# EasyEDA Pro project Board2.epro

# Schematic Schematic2
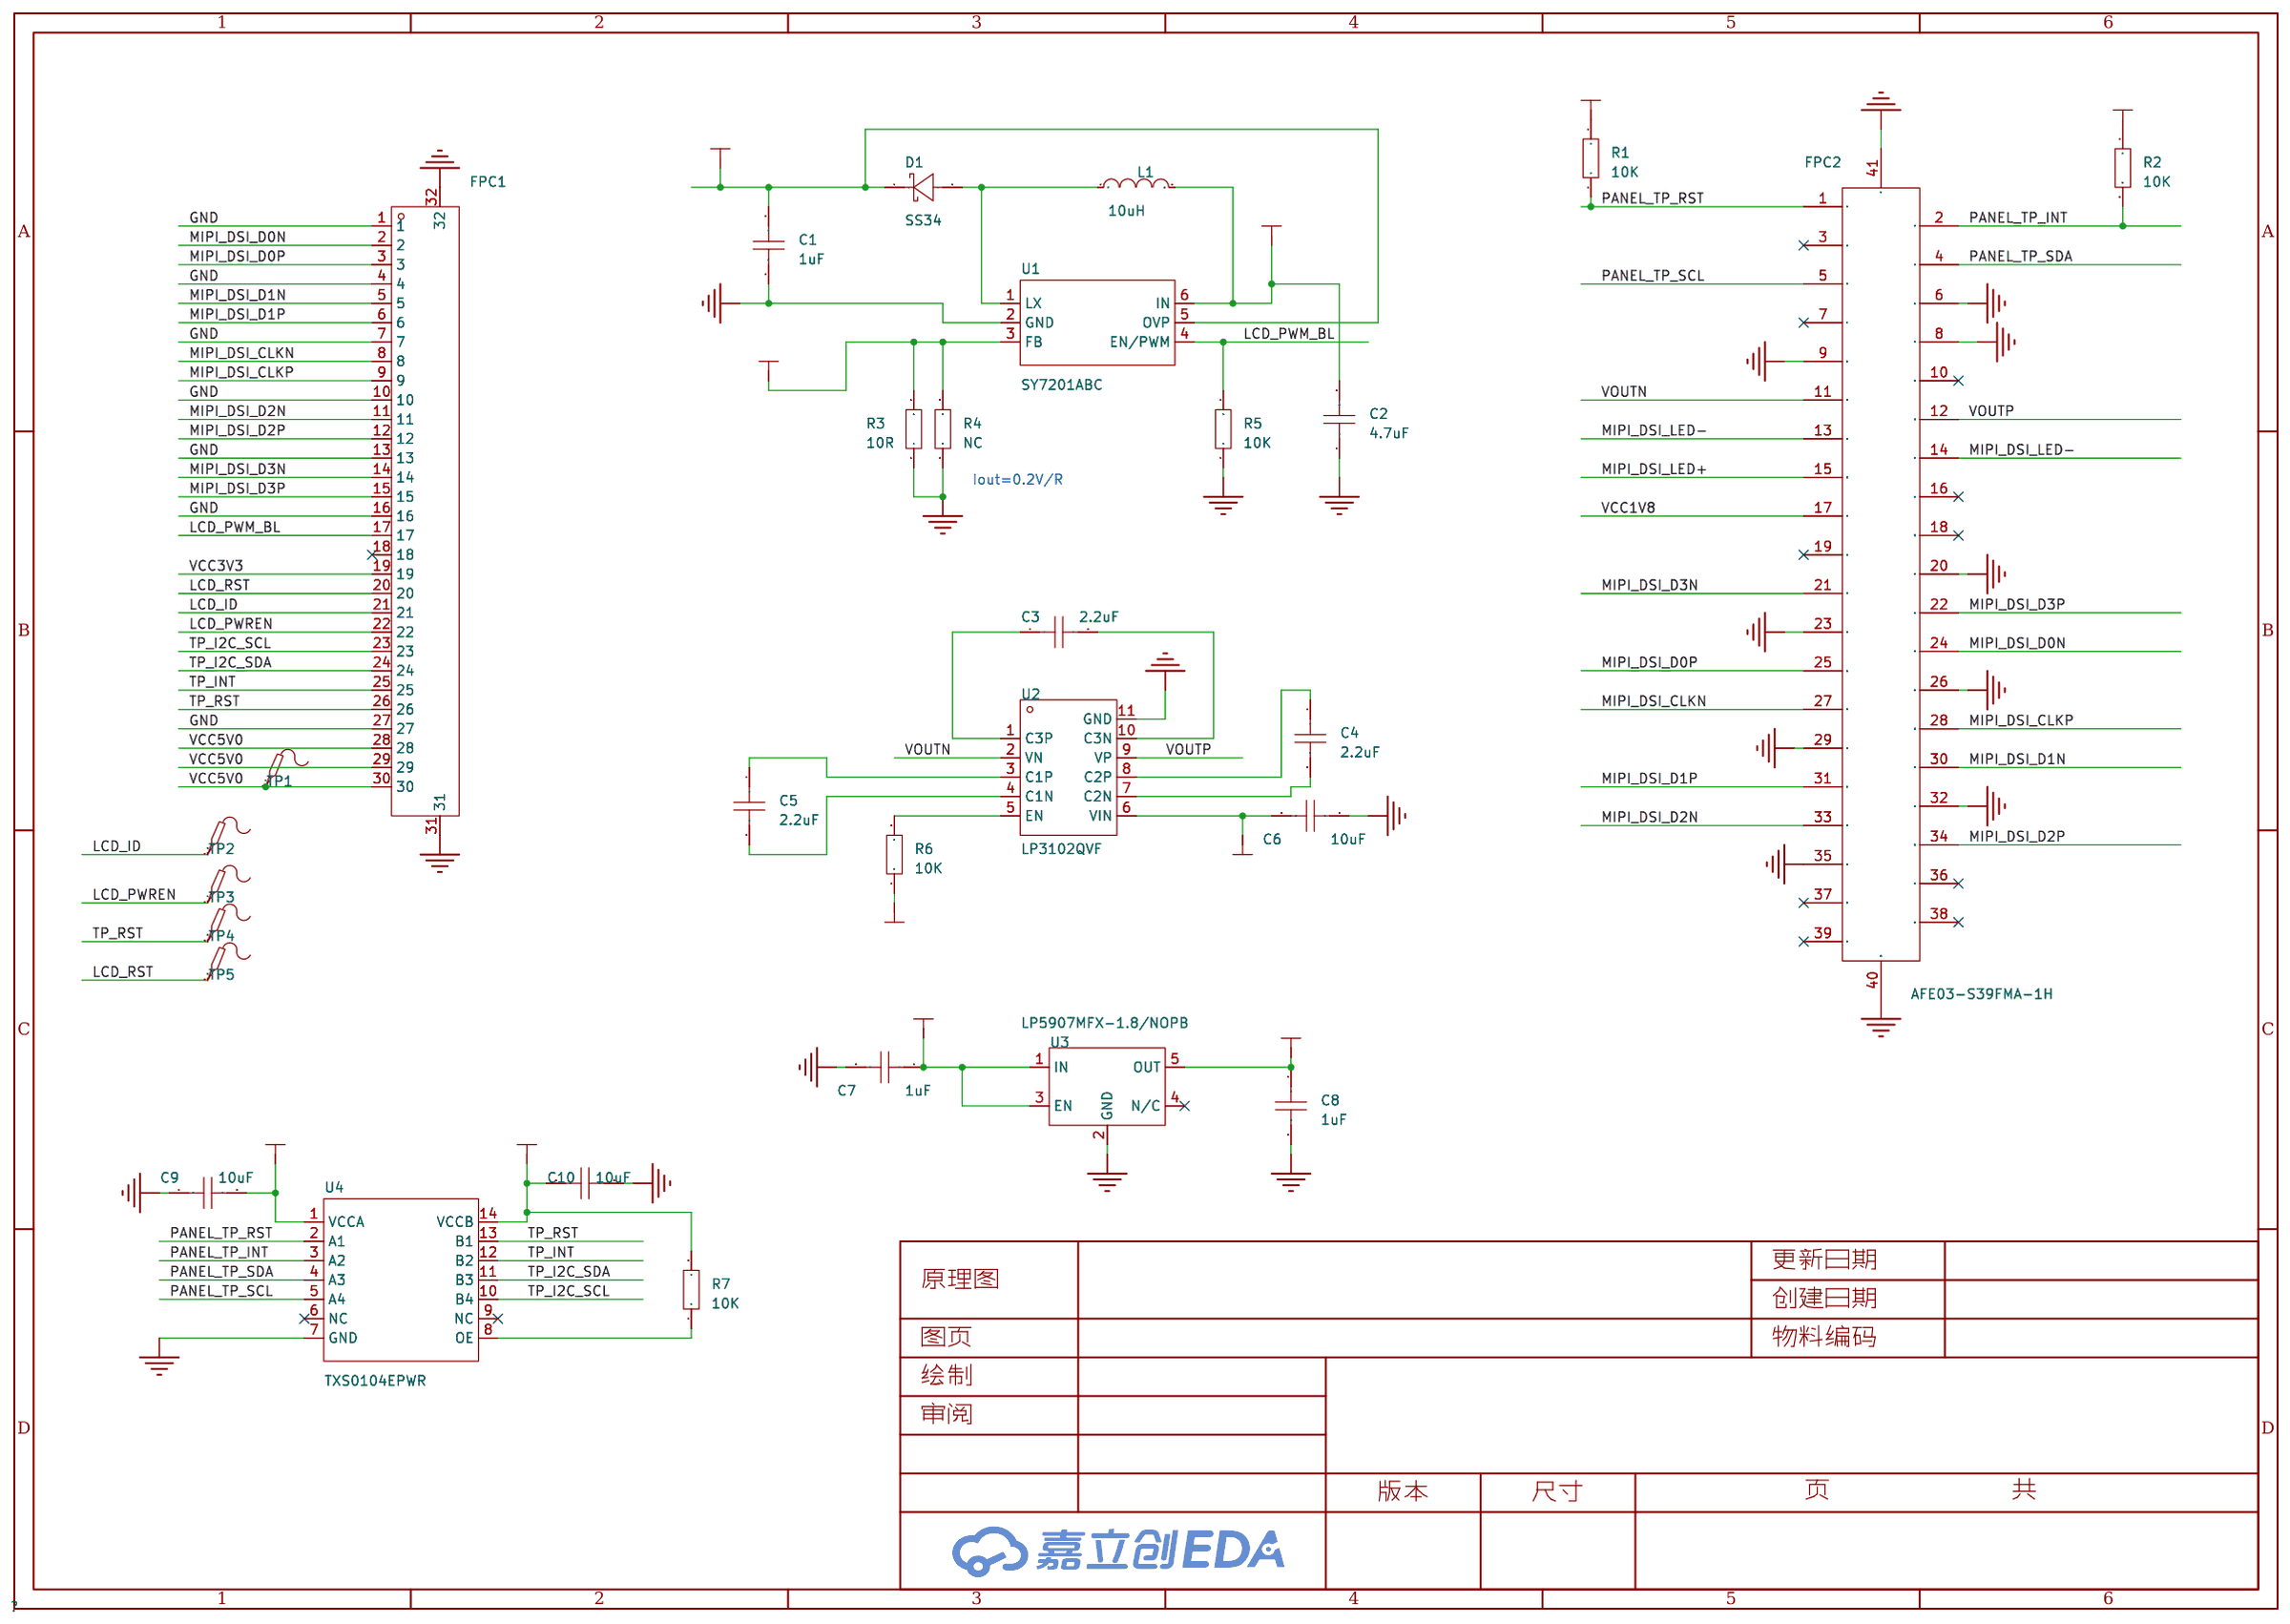
[diagram p0: schematic sheet]

## Parts
C1  1uF  [C0603]
C2  4.7uF  [C0603]
C3  2.2uF  [C0603]
C4  2.2uF  [C0603]
C5  2.2uF  [C0603]
C6  10uF  [C0603]
C7  1uF  [C0603]
C8  1uF  [C0603]
C9  10uF  [C0603]
C10  10uF  [C0603]
D1  SS34  [SMA_L4.2-W2.7-LS5.0-RD]
FPC1  FPC-05F-30PH20  [FPC-SMD_30P-P0.50_XUNPU_FPC-05F-30PH20]
FPC2  AFE03-S39FMA-1H  [FPC-SMD_P0.30-39P_FGS-XJ-H1.0]
L1  10uH  [L0603]
R1  10K  [R0603]
R2  10K  [R0603]
R3  10R  [R0603]
R4  NC  [R0603]
R5  10K  [R0603]
R6  10K  [R0603]
R7  10K  [R0603]
TP1  -  [Test-Point-0.5mm]
TP2  -  [Test-Point-0.5mm]
TP3  -  [Test-Point-0.5mm]
TP4  -  [Test-Point-0.5mm]
TP5  -  [Test-Point-0.5mm]
U1  SY7201ABC  [SOT-23-6_L2.9-W1.6-P0.95-LS2.8-BR]
U2  LP3102QVF  [TDFN-10_L3.0-W3.0-P0.50-BL-EP]
U3  LP5907MFX-1.8/NOPB  [SOT-23-5_L3.0-W1.7-P0.95-LS2.8-BR]
U4  TXS0104EPWR  [TSSOP-14_L5.0-W4.4-P0.65-LS6.4-BL]

## Library data of the parts
C1-C10 = CAP_0603: Supplier Footprint: 0603
D1 = SS34_C2837271: 二极管配置:-;正向压降(Vf):550mV@3A;直流反向耐压(Vr):40V;整流电流:3A;; LCSC Part Name: 电压:40V 电流:3A; Supplier Part: C2837271; Manufacturer: JSMSEMI(杰盛微); Supplier Footprint: SMA(DO-214AC); JLCPCB Part Class: 扩展库; Datasheet: https://item.szlcsc.com/datasheet/SS34/3007843.html; Supplier: LCSC; Voltage - Forward(Vf@If): 550mV@3A; Voltage - DC Reverse(Vr): 40V; Current - Rectified: 3A
FPC1 = FPC-05F-30PH20: 锁定特性:翻盖式;触点类型:卧贴;触点数量:30P;间距:0.5mm;安装方式:下接;工作温度:-25℃~+85℃;; LCSC Part Name: 翻盖式 卧贴 P数:30P 间距:0.5mm; Supplier Part: C2856808; Manufacturer: XUNPU(讯普); Supplier Footprint: SMD,P=0.5mm,卧贴; JLCPCB Part Class: 扩展库; Datasheet: https://item.szlcsc.com/datasheet/FPC-05F-30PH20/3056906.html; Supplier: LCSC; Locking Feature: 翻盖式; Contact Type: 卧贴; Number of Contacts: 30P; Pitch: 0.5mm; Mounting Type: 下接; FFC, FCB Thickness: 0.3mm; Height Above Board: 2mm; Contact Material: 磷青铜; Contact Plating: 锡; Operating Temperature: -25℃~+85℃; Rated Voltage (Max): 50V; Current Rating (Max): 500mA
FPC2 = AFE03-S39FMA-1H: 锁定特性:翻盖式;触点类型:下接;触点数量:39P;间距:0.3mm;安装方式:卧贴;; LCSC Part Name: 翻盖式 下接 P数:39P 间距:0.3mm; Supplier Part: C262546; Manufacturer: JS(钜硕电子); Supplier Footprint: SMD,P=0.3mm,卧贴; JLCPCB Part Class: 扩展库; Datasheet: https://item.szlcsc.com/datasheet/AFE03-S39FMA-1H/253855.html; Supplier: LCSC; Locking Feature: 翻盖式; Contact Type: 下接; Number of Contacts: 39P; Pitch: 0.3mm; Mounting Type: 卧贴; FFC, FCB Thickness: 0.2mm; Height Above Board: 1mm; Contact Material: 铜合金; Contact Plating: 锡
L1 = LQM18FN100M00D: 电感值:10uH;精度:±20%;额定电流:50mA;饱和电流(Isat):50mA;直流电阻(DCR):1.17Ω;; LCSC Part Name: 10uH ±20% 50mA; Supplier Part: C86083; Manufacturer: muRata(村田); Supplier Footprint: 0603; JLCPCB Part Class: 扩展库; Datasheet: https://item.szlcsc.com/datasheet/LQM18FN100M00D/87259.html; Supplier: LCSC; Tolerance: ±20%; Current Rating: 50mA; Current - Saturation (Isat): 50mA; DC Resistance(DCR): 1.17Ω; Frequency - Self Resonant: 30MHz
R1-R7 = Res_0603: Supplier Footprint: 0603
TP1-TP5 = Test-Point: Test Point 测试点
U1 = SY7201ABC: 类型:DC-DC;工作电压(DC):2.5V~30V;开关频率:1MHz;通道数:-;输出电压:-;输出电流:-;调光:PWM;拓扑结构:升压;; LCSC Part Name: 30V高电流升压型LED驱动器; Supplier Part: C82173; Manufacturer: Silergy(矽力杰); Supplier Footprint: SOT-23-6; JLCPCB Part Class: 扩展库; Datasheet: https://item.szlcsc.com/datasheet/SY7201ABC/83328.html; Supplier: LCSC; Type: DC-DC; Voltage - Input(DC): 2.5V~30V; Frequency - Switching: 1MHz; Dimming: PWM; Features: 过温保护(OTP)；过压保护(OVP); Topology: 升压; Operating temperature: -40℃~+125℃; Switch Tube (Built-In/External): 内置
U2 = LP3102QVF: LP3102 DC/DC 转换器集成了两个低噪声、高效率的电荷泵，用于双路输出，包括一路反相输出和一路升压输出。该器件的输入电压范围为 2.5V 至 4.8V，可提供两倍于输入电压的升压输出电压（VP）。负反相输出（VN）是正输出 VP 的 -1 倍反相; LCSC Part Name: 双通道电荷泵电源解决方案，适用于TFT LCD面板; Supplier Part: C517005; Manufacturer: LOWPOWER(微源半导体); Supplier Footprint: TDFN-10-EP(3x3); JLCPCB Part Class: 扩展库; Datasheet: https://item.szlcsc.com/datasheet/LP3102QVF/533370.html; Supplier: LCSC; Operating Voltage: 2.5V~4.8V; Operating Temperature: -40℃~+85℃; Function: 升压；反相; Output Voltage: 5.5V~5.9V；-5.9V~-5.5V; Output Current: 120mA
U3 = LP5907MFX-1.8/NOPB: 输出类型:固定;工作电压:5.5V;输出电压:1.8V;输出电流:250mA;电源纹波抑制比(PSRR):82dB@(1kHz);输出极性:正极;; LCSC Part Name: 具有低 IQ 和使能功能的 250mA、低噪声、高 PSRR、超低压降稳压器; Supplier Part: C92498; Manufacturer: TI(德州仪器); Supplier Footprint: SOT-23-5; JLCPCB Part Class: 扩展库; Datasheet: https://www.ti.com/cn/lit/gpn/lp5907; Supplier: LCSC; Output Type: 固定; Voltage - Supply: 5.5V; Output Voltage: 1.8V; Output Current: 250mA; Power Supply Rejection Ratio (PSRR): 82dB@(1kHz); Voltage Dropout: 120mV@(250mA); standby current: 12uA; Noise: 6.5uVrms; Features: 短路保护；过热保护；带使能；欠压锁定; Operating Temperature: -40℃~+125℃@(Tj); Output Configuration: 正极; Number of Outputs: 1
U4 = TXS0104EPWR: 数据速率:24Mbps;工作电压(VCCA):1.65V~3.6V;工作电压(VCCB):2.3V~5.5V;元件数:1;每个电路通道数:4;; LCSC Part Name: 4位双向电压电平转换器; Supplier Part: C44955; Manufacturer: TI(德州仪器); Supplier Footprint: TSSOP-14; JLCPCB Part Class: 扩展库; Datasheet: https://www.ti.com/cn/lit/gpn/txs0104e; Supplier: LCSC; Channel Type: 双向; Data Rate: 24Mbps; Voltage - Supply(VCCA): 1.65V~3.6V; Voltage - Supply(VCCB): 2.3V~5.5V; Number of Elements: 1; Number of Circuits: 4; Output Type: 推挽式；开漏; Operating Temperature: -40℃~+85℃; Features: 自动方向检测

## Nets
GND: C1.1 C2.1 C6.1 C7.2 C8.2 C9.1 C10.1 FPC1.1 FPC1.4 FPC1.7 FPC1.10 FPC1.13 FPC1.16 FPC1.27 FPC1.31 FPC1.32 FPC2.6 FPC2.8 FPC2.9 FPC2.20 FPC2.23 FPC2.26 FPC2.29 FPC2.32 FPC2.35 FPC2.40 FPC2.41 R3.1 R4.1 R5.1 U1.2(GND) U2.11(GND) U3.2(GND) U4.7(GND)
VCC1V8: C8.1 C9.2 FPC2.17 R1.1 R2.1 U3.5(OUT) U4.1(VCCA)
VCC3V3: C6.2 C10.2 FPC1.19 R6.1 R7.2 U2.6(VIN) U4.14(VCCB)
VCC5V0: C2.2 C7.1 FPC1.28 FPC1.29 FPC1.30 L1.2 TP1.1 U1.6(IN) U3.1(IN) U3.3(EN)
LCD_ID: FPC1.21 TP2.1
LCD_PWM_BL: FPC1.17 R5.2 U1.4(EN/PWM)
LCD_PWREN: FPC1.22 TP3.1
LCD_RST: FPC1.20 TP5.1
MIPI_DSI_CLKN: FPC1.8 FPC2.27
MIPI_DSI_CLKP: FPC1.9 FPC2.28
MIPI_DSI_D0N: FPC1.2 FPC2.24
MIPI_DSI_D0P: FPC1.3 FPC2.25
MIPI_DSI_D1N: FPC1.5 FPC2.30
MIPI_DSI_D1P: FPC1.6 FPC2.31
MIPI_DSI_D2N: FPC1.11 FPC2.33
MIPI_DSI_D2P: FPC1.12 FPC2.34
MIPI_DSI_D3N: FPC1.14 FPC2.21
MIPI_DSI_D3P: FPC1.15 FPC2.22
MIPI_DSI_LED+: C1.2 D1.1(K) FPC2.15 U1.5(OVP)
MIPI_DSI_LED-: FPC2.13 FPC2.14 R3.2 R4.2 U1.3(FB)
PANEL_TP_INT: FPC2.2 R2.2 U4.3(A2)
PANEL_TP_RST: FPC2.1 R1.2 U4.2(A1)
PANEL_TP_SCL: FPC2.5 U4.5(A4)
PANEL_TP_SDA: FPC2.4 U4.4(A3)
TP_I2C_SCL: FPC1.23 U4.10(B4)
TP_I2C_SDA: FPC1.24 U4.11(B3)
TP_INT: FPC1.25 U4.12(B2)
TP_RST: FPC1.26 TP4.1 U4.13(B1)
VOUTN: FPC2.11 U2.2(VN)
VOUTP: FPC2.12 U2.9(VP)
$1N641: D1.2(A) L1.1 U1.1(LX)
$1N1590: C3.1 U2.1(C3P)
$1N1594: C5.1 U2.3(C1P)
$1N1596: C5.2 U2.4(C1N)
$1N1598: R6.2 U2.5(EN)
$1N1600: C4.2 U2.7(C2N)
$1N1602: C4.1 U2.8(C2P)
$1N1606: C3.2 U2.10(C3N)
$1N4917: R7.1 U4.8(OE)

Not connected (* = marked no-connect by the designer): FPC1 18*; FPC2 3* 7* 10* 16* 18* 19* 36* 37* 38* 39*; U3 4(N/C)*; U4 6(NC)* 9(NC)*

## Notes on the sheet
- Iout=0.2V/R

# Board PCB2
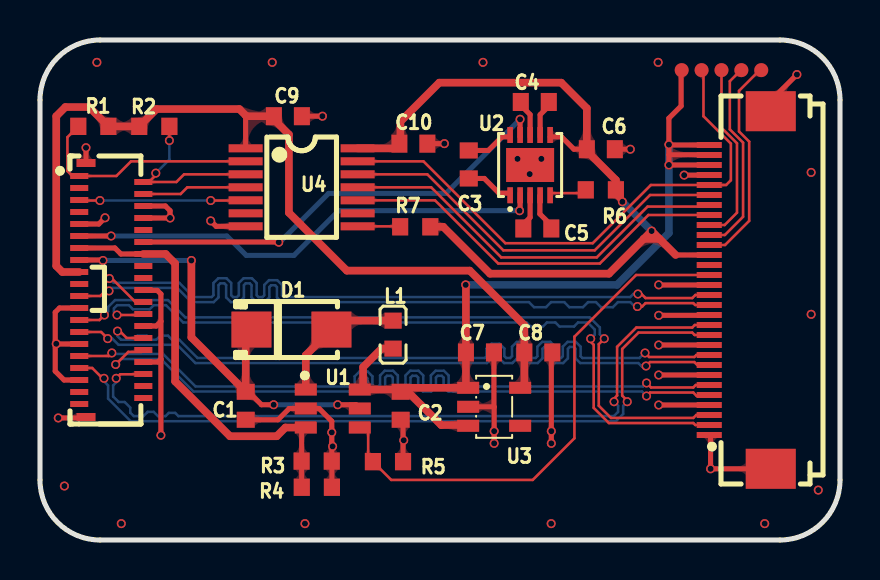
[diagram p1: board, top side]
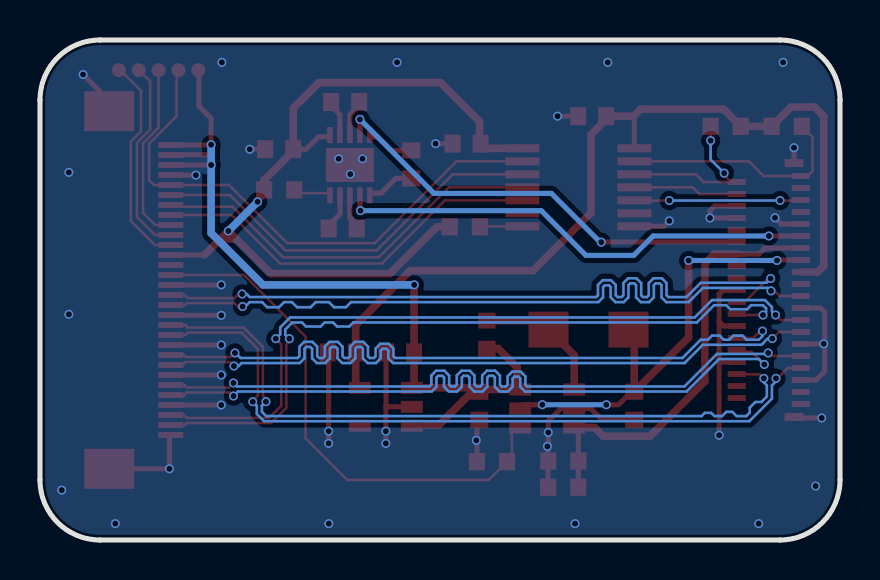
[diagram p2: board, bottom side, seen from below]

Outline 40 x 25 mm; copper layers: Top Layer, Bottom Layer. Coordinates in mm from the lower left corner of the outline.
Outline path: 0,22 0,3 arc(0.88,0.88) 3,0 37,0 arc(39.12,0.88) 40,3 40,22 arc(39.12,24.12) 37,25 3,25 arc(0.88,24.12) 0,22
Stack: Top Layer 0.035mm / Dielectric1 1.51mm FR4 er 4.5 / Bottom Layer 0.035mm

## Design rules (mm)
net MIPI_DSI_D3P: DP5
net MIPI_DSI_D3N: DP5
net MIPI_DSI_D2P: DP4
net MIPI_DSI_D2N: DP4
net MIPI_DSI_CLKP: DP1
net MIPI_DSI_CLKN: DP1
net MIPI_DSI_D1P: DP3
net MIPI_DSI_D1N: DP3
net MIPI_DSI_D0P: DP2
net MIPI_DSI_D0N: DP2
template: 用户自定义配置
spacing copperThickness1oz (default): track to track 0.102, other pairs 0.127 to 0.3
spacing copperThickness2oz: track to track 0.203, other pairs 0.152 to 0.3
track width copperThickness1oz (default): min 0.127, default 0.127, max 2.54
track width copperThickness2oz: min 0.203, default 0.254, max 2.54
track width 10mil: min 0.127, default 0.254, max 2.54
differential pair differentialPair (default): width min 0.127, default 0.127, max 2.54; gap min 0.127, default 0.127
via viaSize (default): diameter min 0.4, default 0.45, max 10; hole min 0.3, default 0.305, max 6.3
net MIPI_DSI_LED+ uses 10mil
net GND uses 10mil
net VCC5V0 uses 10mil
net VCC3V3 uses 10mil
net VCC1V8 uses 10mil
net VOUTN uses 10mil
net VOUTP uses 10mil
net MIPI_DSI_LED- uses 10mil

## Placement (name value [footprint] x y rotation side)
C1  1uF  [C0603]  10.29 6.71 90 top
C2  4.7uF  [C0603]  18.03 6.71 90 top
C3  2.2uF  [C0603]  21.44 18.78 90 top
C4  2.2uF  [C0603]  24.74 21.9 0 top
C5  2.2uF  [C0603]  24.87 15.58 0 top
C6  10uF  [C0603]  28.04 19.54 180 top
C7  1uF  [C0603]  22 9.38 0 top
C8  1uF  [C0603]  24.92 9.38 0 top
C9  10uF  [C0603]  12.4 21.19 180 top
C10  10uF  [C0603]  18.67 19.82 180 top
D1  SS34  [SMA_L4.2-W2.7-LS5.0-RD]  12.57 10.52 0 top
FPC1  FPC-05F-30PH20  [FPC-SMD_30P-P0.50_XUNPU_FPC-05F-30PH20]  35 12.5 90 top
FPC2  AFE03-S39FMA-1H  [FPC-SMD_P0.30-39P_FGS-XJ-H1.0]  3.5 12.5 270 top
L1  10uH  [L0603]  17.65 10.27 270 top
R1  10K  [R0603]  2.67 20.68 180 top
R2  10K  [R0603]  5.72 20.68 0 top
R3  10R  [R0603]  13.84 3.94 180 top
R4  NC  [R0603]  13.84 2.64 180 top
R5  10K  [R0603]  17.4 3.92 180 top
R6  10K  [R0603]  28.04 17.51 180 top
R7  10K  [R0603]  18.76 15.66 0 top
TP1  -  [Test-Point-0.5mm]  32.08 23.49 90 top
TP2  -  [Test-Point-0.5mm]  35.07 23.49 90 top
TP3  -  [Test-Point-0.5mm]  34.07 23.49 90 top
TP4  -  [Test-Point-0.5mm]  33.08 23.49 90 top
TP5  -  [Test-Point-0.5mm]  36.06 23.49 90 top
U1  SY7201ABC  [SOT-23-6_L2.9-W1.6-P0.95-LS2.8-BR]  14.64 6.57 180 top
U2  LP3102QVF  [TDFN-10_L3.0-W3.0-P0.50-BL-EP]  24.51 18.75 0 top
U3  LP5907MFX-1.8/NOPB  [SOT-23-5_L3.0-W1.7-P0.95-LS2.8-BR]  22.71 6.66 180 top
U4  TXS0104EPWR  [TSSOP-14_L5.0-W4.4-P0.65-LS6.4-BL]  13.08 17.63 270 top

## Footprints (pads in the part's own frame, mm; a bottom-side part is the same pattern mirrored in y, then rotated)
C0603
  rect 0.8x0.9 smd: 1(-0.7,0) 2(0.7,0)
FPC-SMD_30P-P0.50_XUNPU_FPC-05F-30PH20
  rect 0.3x1.25 smd: 1(-7.25,1.538) 2(-6.75,1.538) 3(-6.25,1.538) 4(-5.75,1.538) 5(-5.25,1.538) 6(-4.75,1.538) 7(-4.25,1.538) 8(-3.75,1.538) 9(-3.25,1.538) 10(-2.75,1.538) 11(-2.25,1.538) 12(-1.75,1.538) 13(-1.25,1.538) 14(-0.75,1.538) 15(-0.25,1.538) 16(0.25,1.538) 17(0.75,1.538) 18(1.25,1.538) 19(1.75,1.538) 20(2.25,1.538) 21(2.75,1.538) 22(3.25,1.538) 23(3.75,1.538) 24(4.25,1.538) 25(4.75,1.538) 26(5.25,1.538) 27(5.75,1.538) 28(6.25,1.538) 29(6.75,1.538) 30(7.25,1.538)
  rect 2x2.5 smd: 31(8.94,-1.538) 32(-8.94,-1.538)
FPC-SMD_P0.30-39P_FGS-XJ-H1.0
  rect 0.3x0.9 smd: 1(-5.7,-1.54) 2(-5.4,1.665) 3(-5.1,-1.54) 4(-4.8,1.665) 5(-4.5,-1.54) 6(-4.2,1.665) 7(-3.9,-1.54) 8(-3.6,1.665) 9(-3.3,-1.54) 10(-3,1.665) 11(-2.7,-1.54) 12(-2.4,1.665) 13(-2.1,-1.54) 14(-1.8,1.665) 15(-1.5,-1.54) 16(-1.2,1.665) 17(-0.9,-1.54) 18(-0.6,1.665) 19(-0.3,-1.54) 20(0,1.665) 21(0.3,-1.54) 22(0.6,1.665) 23(0.9,-1.54) 24(1.2,1.665) 25(1.5,-1.54) 26(1.8,1.665) 27(2.1,-1.54) 28(2.4,1.665) 29(2.7,-1.54) 30(3,1.665) 31(3.3,-1.54) 32(3.6,1.665) 33(3.9,-1.54) 34(4.2,1.665) 35(4.5,-1.54) 36(4.8,1.665) 37(5.1,-1.54) 38(5.4,1.665) 39(5.7,-1.54)
  rect 0.4x0.95 smd: 40(-6.35,-1.2) 41(6.35,-1.2)
L0603
  rect 0.8x0.864 smd: 1(-0.7,0) 2(0.7,0)
R0603
  rect 0.806x0.864 smd: 1(-0.753,0) 2(0.753,0)
SMA_L4.2-W2.7-LS5.0-RD
  rect 2x1.8 smd: 1(-2,0) 2(2,0)
SOT-23-5_L3.0-W1.7-P0.95-LS2.8-BR
  rect 1.1x0.6 smd: 1(1.3,-0.95) 2(1.3,0) 3(1.3,0.95) 4(-1.3,0.95) 5(-1.3,-0.95)
SOT-23-6_L2.9-W1.6-P0.95-LS2.8-BR
  rect 1.1x0.6 smd: 1(1.35,-0.95) 2(1.35,0) 3(1.35,0.95) 4(-1.35,0.95) 5(-1.35,0) 6(-1.35,-0.95)
TDFN-10_L3.0-W3.0-P0.50-BL-EP
  rect 0.28x0.8 smd: 1(-1,-1.513) 2(-0.5,-1.513) 3(0,-1.513) 4(0.5,-1.513) 5(1,-1.513) 6(1,1.5) 7(0.5,1.5) 8(0,1.5) 9(-0.5,1.5) 10(-1,1.5)
  rect 2.4x1.7 smd: 11(0,0)
Test-Point-0.5mm
  round 0.7 smd: 1(0,0)
TSSOP-14_L5.0-W4.4-P0.65-LS6.4-BL
  rect 0.4x1.7 smd: 1(-1.95,-2.8) 2(-1.3,-2.8) 3(-0.65,-2.8) 4(0,-2.8) 5(0.65,-2.8) 6(1.3,-2.8) 7(1.95,-2.8) 8(1.95,2.8) 9(1.3,2.8) 10(0.65,2.8) 11(0,2.8) 12(-0.65,2.8) 13(-1.3,2.8) 14(-1.95,2.8)

## Nets
As in the schematic.

Pads without a net: FPC1 18; FPC2 3 7 10 16 18 19 36 37 38 39; U3 4; U4 6 9

## Via types
v1: diameter 0.45, hole 0.305, Top Layer to Bottom Layer, 77 vias

## Routing (per net, layer and track width the routed paths; a pad name or vN(x,y) marks a point on that pad's centre or on a via; arc(x,y) is an arc through that point)
GND: length 69.9
  Top Layer w0.254: 6.04,9.05 6.04,10.93 ; 6.04,9.05 5.9,8.9 FPC2.32 ; 6.04,9.05 v1(6.04,5.24) ; 6.04,10.93 6.04,12.3 5.87,12.48 5.19,12.48 FPC2.20 ; 6.04,10.93 5.82,10.7 FPC2.26 ; FPC1.4 v1(30.94,6.75) ; FPC1.7 v1(30.94,8.25) ; C2.1 18.15,5.89 18.15,4.99 ; 14.59,4.86 R3.1 14.6,3.94 R4.1 ; 14.59,4.86 v1(14.63,4.68) ; 14.59,4.86 v1(14.59,5.38) 14.59,5.94 13.96,6.57 12.46,6.57 11.9,6.01 C1.1 ; FPC1.32 v1(33.53,3.56) 33.53,5.18 FPC1.1 ; v1(0.81,9.81) 0.76,9.76 0.76,8.44 1.2,8 FPC2.35 ; v1(0.81,9.81) 0.76,9.86 0.76,11.39 0.98,11.6 FPC2.23 ; v1(0.81,9.81) 0.82,9.8 FPC2.29 ; FPC1.10 v1(30.94,9.75) ; v1(37.85,23.27) 36.54,21.96 FPC1.31 ; 22.7,6.66 22.71,6.65 v1(22.71,5.44) v1(22.71,4.83) ; 22.7,6.66 C7.2 ; 22.7,6.66 U3.2 ; v1(30.94,11.23) 33.45,11.23 FPC1.13 ; FPC2.8 v1(6.5,16.1) 6.5,16.47 6.27,16.7 FPC2.6 ; v1(3.25,16.11) 2.94,15.8 FPC2.9 ; v1(0.91,6.1) 2.25,6.1 FPC2.41 ; v1(8.53,15.96) 8.81,15.68 U4.7 ; 18.15,4.99 R5.1 ; 18.15,4.99 v1(18.19,4.99) ; C6.1 v1(29.51,19.54) ; v1(25.57,4.83) v1(25.57,5.44) 25.57,9.33 C8.2 ; FPC2.40 v1(2.3,19.61) ; C10.1 v1(20.22,19.82) ; C9.1 v1(14.12,21.19) ; FPC1.16 30.94,12.75 v1(30.94,12.76) ; v1(32.21,18.24) 33.46,18.24 FPC1.27
  vias: v1(1.22,2.7) v1(2.84,23.88) v1(4.06,0.82) v1(11.61,23.88) v1(13.25,0.82) v1(22.15,23.88) v1(23.88,19.06) v1(24.49,18.29) v1(25.07,19.06) v1(25.56,0.82) v1(30.91,23.88) v1(36.23,0.82) v1(38.56,18.38) v1(38.56,11.28) v1(38.91,2.5)
VCC1V8: length 44.9
  Top Layer w0.254: 10.28,21.23 U4.1 10.3,19.56
  Top Layer w0.381: FPC2.17 1.12,13.4 0.81,13.7 0.81,21.19 1.27,21.65 2.46,21.65 R1.1 R2.1 5.82,21.55 9.97,21.55 10.32,21.19 C9.2 11.69,21.03 12.45,20.28 12.45,16.36 15.34,13.47 21.49,13.47 24.22,10.74 C8.1 24.22,7.82 U3.5
VCC3V3: length 40.6
  Top Layer w0.254: v1(29.12,16.91) 28.79,17.24 R6.1 ; C6.2 26.7,19.54 26.08,20.16 25.51,20.16 ; FPC1.19 31.78,14.25
  Top Layer w0.381: U4.14 17.73,19.58 18.02,19.87 18.02,20.92 19.96,22.87 26.06,22.87 27.34,21.58 C6.2 27.34,19.45 28.79,18 R6.1 ; 30.19,15.06 28.45,13.32 22.5,13.32 20.16,15.66 R7.2 ; 30.19,15.06 v1(30.58,15.45) 30.98,15.06 ; 30.19,15.06 30.98,15.06 ; 30.98,15.06 31.78,14.25
  Bottom Layer w0.381: v1(30.58,15.45) v1(29.12,16.91)
VCC5V0: length 44.6
  Top Layer w0.254: FPC1.29 33.45,19.26 31.44,19.26 ; v1(31.44,19.77) 31.44,19.26 ; v1(31.44,19.77) 31.44,21.09 32.06,21.7 32.06,23.46 TP1.1 ; v1(31.44,19.77) 31.46,19.75 FPC1.30 ; 31.44,19.26 v1(31.44,18.75) FPC1.28
  Top Layer w0.381: v1(21.28,12.76) 21.3,12.75 C7.1 21.3,7.72 U3.1 18.23,7.61 C2.2 ; U3.3 21.37,5.75 20.06,5.75 18.39,7.41 C2.2 ; C2.2 17.92,7.52 U1.6 16.15,7.69 16.15,8.64 17.08,9.57 L1.2
  Bottom Layer w0.381: v1(31.44,19.77) v1(31.44,18.75) 31.44,15.35 28.85,12.76 v1(21.28,12.76)
LCD_ID: length 10.1
  Top Layer w0.127: FPC1.21 34.24,15.25 35.15,16.16 35.15,19.87 34.49,20.53 34.49,22.94 35.04,23.49 34.84,23.49
LCD_PWM_BL: length 26.5
  Top Layer w0.127: U1.4 16.18,5.62 16.41,5.39 16.41,4.16 R5.2 17.56,3 24.64,3 26.72,5.09 26.72,10.17 29.8,13.25 FPC1.17
LCD_PWREN: length 9.1
  Top Layer w0.127: FPC1.22 34.24,15.75 34.85,16.36 34.85,19.84 34.07,20.61 TP3.1
LCD_RST: length 10.7
  Top Layer w0.127: 36.06,23.39 35.88,23.39 34.95,22.46 34.95,20.43 35.46,19.92 35.46,15.96 34.25,14.75 FPC1.20
MIPI_DSI_CLKN: length 37.1
  Top Layer w0.127: v1(30.3,8.7) 30.5,8.9 32.72,8.9 32.91,8.7 33.41,8.7 FPC1.8 ; v1(3.39,10.07) 3.06,10.4 FPC2.27
  Bottom Layer w0.127: v1(30.3,8.7) 30.07,8.7 29.92,8.85 27.01,8.85 26.78,9.08 26.78,9.56 26.69,9.65 26.48,9.65 26.39,9.56 26.39,9.08 26.16,8.85 25.74,8.85 25.51,9.08 25.51,9.56 25.42,9.65 25.21,9.65 25.12,9.56 25.12,9.08 24.89,8.85 24.47,8.85 24.24,9.08 24.24,9.56 24.15,9.65 23.94,9.65 23.85,9.56 23.85,9.08 23.62,8.85 23.2,8.85 22.97,9.08 22.97,9.47 22.88,9.56 22.67,9.56 22.58,9.47 22.58,9.08 22.35,8.85 7.77,8.85 6.86,9.76 3.93,9.76 3.62,10.07 v1(3.39,10.07)
MIPI_DSI_CLKP: length 37
  Top Layer w0.127: FPC2.28 4.33,10.1 3.99,10.45 v1(3.88,10.45) ; v1(30.25,9.35) 30.45,9.15 32.72,9.15 32.81,9.25 FPC1.9
  Bottom Layer w0.127: v1(30.25,9.35) 30.22,9.35 29.97,9.1 27.12,9.1 27.03,9.19 27.03,9.67 26.79,9.91 26.38,9.91 26.14,9.67 26.14,9.19 26.05,9.1 25.85,9.1 25.76,9.19 25.76,9.67 25.52,9.91 25.11,9.91 24.87,9.67 24.87,9.19 24.78,9.1 24.58,9.1 24.49,9.19 24.49,9.67 24.25,9.91 23.84,9.91 23.6,9.67 23.6,9.19 23.51,9.1 23.31,9.1 23.22,9.19 23.22,9.57 22.98,9.81 22.57,9.81 22.33,9.57 22.33,9.19 22.24,9.1 7.88,9.1 6.96,10.01 6.6,10.01 6.4,10.22 6.02,10.22 5.81,10.01 5.54,10.01 5.33,10.22 4.88,10.22 4.67,10.01 4.05,10.01 3.88,10.19 v1(3.88,10.45)
MIPI_DSI_D0N: length 37
  Top Layer w0.127: FPC1.2 32.76,5.75 32.66,5.85 28.44,5.85 27.69,6.61 27.69,9.76 27.53,9.91 v1(27.53,10.06) ; v1(3.85,11.25) 5.11,11.25 FPC2.24
  Bottom Layer w0.127: v1(27.53,10.06) 27.74,10.27 27.74,10.52 27.38,10.88 26.9,10.88 26.7,10.67 25.97,10.67 25.77,10.88 25.35,10.88 25.15,10.67 24.54,10.67 24.33,10.88 7.16,10.88 6.3,11.74 5.69,11.74 5.49,11.54 4.65,11.54 4.44,11.74 3.86,11.74 3.7,11.58 3.7,11.4 v1(3.85,11.25)
MIPI_DSI_D0P: length 37.1
  Top Layer w0.127: v1(3.22,11.25) 2.97,11 FPC2.25 ; v1(28.21,10.06) 27.94,9.79 27.94,6.71 28.55,6.1 32.66,6.1 32.81,6.25 FPC1.3
  Bottom Layer w0.127: v1(3.22,11.25) 3.4,11.43 3.4,11.65 3.75,12 6.4,12 7.26,11.13 27.49,11.13 27.99,10.63 27.99,10.29 v1(28.21,10.06)
MIPI_DSI_D1N: length 37.1
  Top Layer w0.127: FPC2.30 5.07,9.4 4.41,9.4 v1(3.78,8.78) ; v1(30.33,7.2) 30.5,7.37 32.66,7.37 32.84,7.2 33.41,7.2 FPC1.5
  Bottom Layer w0.127: v1(3.78,8.78) 4.06,9.05 6.04,9.05 7.67,7.42 15.75,7.42 15.99,7.66 15.99,8.08 16.08,8.17 16.28,8.17 16.37,8.08 16.37,7.66 16.61,7.42 17.02,7.42 17.26,7.66 17.26,8.12 17.35,8.21 17.55,8.21 17.64,8.12 17.64,7.66 17.88,7.42 18.29,7.42 18.53,7.66 18.53,8.12 18.62,8.21 18.82,8.21 18.91,8.12 18.91,7.66 19.15,7.42 19.56,7.42 19.8,7.66 19.8,8.12 19.89,8.21 20.09,8.21 20.18,8.12 20.18,7.66 20.42,7.42 30.1,7.42 v1(30.33,7.2)
MIPI_DSI_D1P: length 37.2
  Top Layer w0.127: FPC2.31 3.44,9.2 v1(3.59,9.35) ; FPC1.6 32.79,7.75 32.66,7.63 30.55,7.63 v1(30.33,7.85)
  Bottom Layer w0.127: v1(3.59,9.35) 3.64,9.3 6.15,9.3 7.78,7.68 15.64,7.68 15.73,7.77 15.73,8.18 15.97,8.42 16.38,8.42 16.62,8.18 16.62,7.77 16.71,7.68 16.91,7.68 17,7.77 17,8.23 17.24,8.46 17.65,8.46 17.89,8.23 17.89,7.77 17.98,7.68 18.18,7.68 18.27,7.77 18.27,8.23 18.51,8.46 18.92,8.46 19.16,8.23 19.16,7.77 19.25,7.68 19.45,7.68 19.54,7.77 19.54,8.23 19.78,8.46 20.19,8.46 20.43,8.23 20.43,7.77 20.52,7.68 30.15,7.68 v1(30.33,7.85)
MIPI_DSI_D2N: length 37.1
  Top Layer w0.127: FPC1.11 32.73,10.25 32.61,10.37 29.93,10.37 29.11,9.55 29.11,7.22 29.36,6.97 v1(29.36,6.92) ; v1(3.2,8.08) 3.13,8.08 2.61,8.6 FPC2.33
  Bottom Layer w0.127: v1(29.36,6.92) 29.16,6.71 29.16,6.3 28.8,5.94 4.53,5.94 3.4,7.07 3.4,7.73 3.2,7.93 v1(3.2,8.08)
MIPI_DSI_D2P: length 37.1
  Top Layer w0.127: FPC1.12 32.74,10.75 32.61,10.62 29.82,10.62 28.85,9.66 28.85,7.22 28.7,7.07 v1(28.7,6.92) ; FPC2.34 5.15,8.29 4.01,8.29 v1(3.81,8.08)
  Bottom Layer w0.127: v1(3.81,8.08) 3.81,7.88 3.66,7.73 3.66,7.17 3.93,6.9 4.23,6.9 4.51,6.62 4.51,6.37 4.69,6.19 5.17,6.19 5.38,6.41 5.69,6.41 5.9,6.19 6.28,6.19 6.44,6.36 6.76,6.36 6.92,6.19 28.69,6.19 28.91,6.41 28.91,6.71 v1(28.7,6.92)
MIPI_DSI_D3N: length 37.1
  Top Layer w0.127: FPC1.14 32.76,11.75 32.66,11.84 30.28,11.84 30.11,11.67 v1(29.87,11.67) ; FPC2.21 3.02,12.2 3.27,12.45 v1(3.45,12.45)
  Bottom Layer w0.127: v1(3.45,12.45) 3.6,12.61 6.86,12.61 7.57,11.89 8.69,11.89 8.93,12.13 8.93,12.74 9.02,12.83 9.22,12.83 9.31,12.74 9.31,12.13 9.55,11.89 9.96,11.89 10.2,12.13 10.2,12.74 10.29,12.83 10.49,12.83 10.58,12.74 10.58,12.13 10.82,11.89 11.23,11.89 11.47,12.13 11.47,12.65 11.56,12.74 11.76,12.74 11.85,12.65 11.85,12.13 12.09,11.89 24.45,11.89 24.7,11.64 25.3,11.64 25.55,11.89 26.21,11.89 26.47,11.64 27.15,11.64 27.4,11.89 27.8,11.89 28.05,11.64 28.64,11.64 28.9,11.89 29.51,11.89 29.74,11.67 v1(29.87,11.67)
MIPI_DSI_D3P: length 37.1
  Top Layer w0.127: v1(29.9,12.3) 30.07,12.3 30.28,12.1 32.61,12.1 32.77,12.25 FPC1.15 ; v1(3.47,13.07) 3.59,13.07 4.77,11.9 FPC2.22
  Bottom Layer w0.127: v1(29.9,12.3) 29.67,12.3 29.51,12.15 12.19,12.15 12.1,12.24 12.1,12.75 11.86,12.99 11.45,12.99 11.21,12.75 11.21,12.24 11.12,12.15 10.92,12.15 10.83,12.24 10.83,12.85 10.59,13.09 10.18,13.09 9.94,12.85 9.94,12.24 9.85,12.15 9.65,12.15 9.56,12.24 9.56,12.85 9.32,13.09 8.91,13.09 8.67,12.85 8.67,12.24 8.58,12.15 7.67,12.15 6.96,12.86 3.68,12.86 v1(3.47,13.07)
MIPI_DSI_LED+: length 22.6
  Top Layer w0.254: v1(3.15,13.98) 3.13,14 FPC2.15 ; C1.2 10.43,7.41 11.07,6.76 v1(11.68,6.76) ; U1.5 15.8,6.76 v1(14.88,6.76)
  Top Layer w0.381: D1.1 10.29,10.24 C1.2 7.57,10.13 v1(7.57,13.98)
  Bottom Layer w0.254: v1(7.57,13.98) v1(3.15,13.98) ; v1(11.68,6.76) v1(14.88,6.76)
MIPI_DSI_LED-: length 21.9
  Top Layer w0.254: 13.29,5.62 13.08,5.42 R3.2 13.08,2.65 R4.2 ; FPC2.13 3.75,14.6 4.05,14.3 FPC2.14
  Top Layer w0.381: 13.29,5.62 12.27,5.62 11.84,5.19 9.5,5.19 6.76,7.93 6.76,13.82 6.28,14.3 FPC2.14
PANEL_TP_INT: length 8.5
  Top Layer w0.127: R2.2 v1(6.47,19.97) ; U4.3 7.2,18.28 6.82,17.9 5.45,17.9 ; 5.45,17.9 FPC2.2 ; 5.45,17.9 5.79,18.24 v1(5.79,18.34)
  Bottom Layer w0.127: v1(5.79,18.34) 6.47,19.02 v1(6.47,19.97)
PANEL_TP_RST: length 11.8
  Top Layer w0.127: U4.2 4.55,18.93 3.82,18.2 FPC2.1 1.62,18.2 1.37,18.45 1.37,20.14 R1.2
PANEL_TP_SCL: length 8.3
  Top Layer w0.127: FPC2.5 1.99,16.97 v1(3,16.97) ; v1(8.53,16.97) 10.27,16.97 U4.5
  Bottom Layer w0.127: v1(8.53,16.97) v1(3,16.97)
PANEL_TP_SDA: length 5.3
  Top Layer w0.127: FPC2.4 7.03,17.3 7.37,17.63 U4.4
TP_I2C_SCL: length 19.9
  Top Layer w0.127: FPC1.23 30.42,16.25 27.99,13.82 22.91,13.82 19.75,16.98 U4.10
TP_I2C_SDA: length 20.1
  Top Layer w0.127: FPC1.24 33.38,16.67 30.38,16.67 27.84,14.13 23.06,14.13 19.56,17.63 U4.11
TP_INT: length 20.3
  Top Layer w0.127: FPC1.25 30.5,17.25 27.74,14.48 23.16,14.48 19.37,18.28 U4.12
TP_RST: length 27.6
  Top Layer w0.127: U4.13 19.17,18.93 23.27,14.84 27.63,14.84 30.54,17.75 FPC1.26 34.3,17.75 34.54,17.99 34.54,19.82 33.17,21.19 33.17,23.39
VOUTN: length 24.2
  Top Layer w0.254: v1(23.98,16.47) 24.01,16.49 24.01,17.34 ; FPC2.11 v1(3.56,15.2)
  Bottom Layer w0.254: v1(3.56,15.2) 9.34,15.2 10.31,14.23 12.7,14.23 14.94,16.47 v1(23.98,16.47)
VOUTP: length 22.3
  Top Layer w0.254: 24.01,20.16 24,20.16 v1(24,21.03) ; FPC2.12 11.93,14.9 v1(11.94,14.89)
  Bottom Layer w0.254: v1(24,21.03) 20.3,17.33 14.43,17.33 11.99,14.89 v1(11.94,14.89)
$1N641: length 6.8
  Top Layer w0.381: L1.1 15.02,10.97 D1.2 13.29,9.24 13.29,7.52
$1N1590: length 2.4
  Top Layer w0.254: C3.1 22.21,18.08 22.95,17.34 23.51,17.34
$1N1594: length 1.8
  Top Layer w0.254: 24.51,17.34 24.51,16.13 24.17,15.79 24.17,15.73
$1N1596: length 1.7
  Top Layer w0.254: 25.57,15.73 24.99,16.3 24.99,17.22
$1N1598: length 1.9
  Top Layer w0.127: R6.2 27.12,17.34 25.51,17.34
$1N1600: length 1.7
  Top Layer w0.254: 25.01,20.16 25.01,21.26 25.44,21.7
$1N1602: length 1.8
  Top Layer w0.254: 24.51,20.16 24.51,21.27 24.08,21.7 24.04,21.7
$1N1606: length 2.4
  Top Layer w0.254: C3.2 22.42,19.48 23.1,20.16 23.51,20.16
$1N4917: length 2.1
  Top Layer w0.127: R7.1 17.99,15.68 U4.8

## Copper pours and planes (outline as drawn; the poured copper is in the pictures)
GND on Bottom Layer: -1.22,26.12 41.1,26.12 41.1,-1.67 -1.22,-1.67

Small or netless copper shapes (teardrops, artwork), in the pictures only: 187 on Top Layer, 18 on Bottom Layer
